# Altium schematic sheet pcb.SchDoc
size A
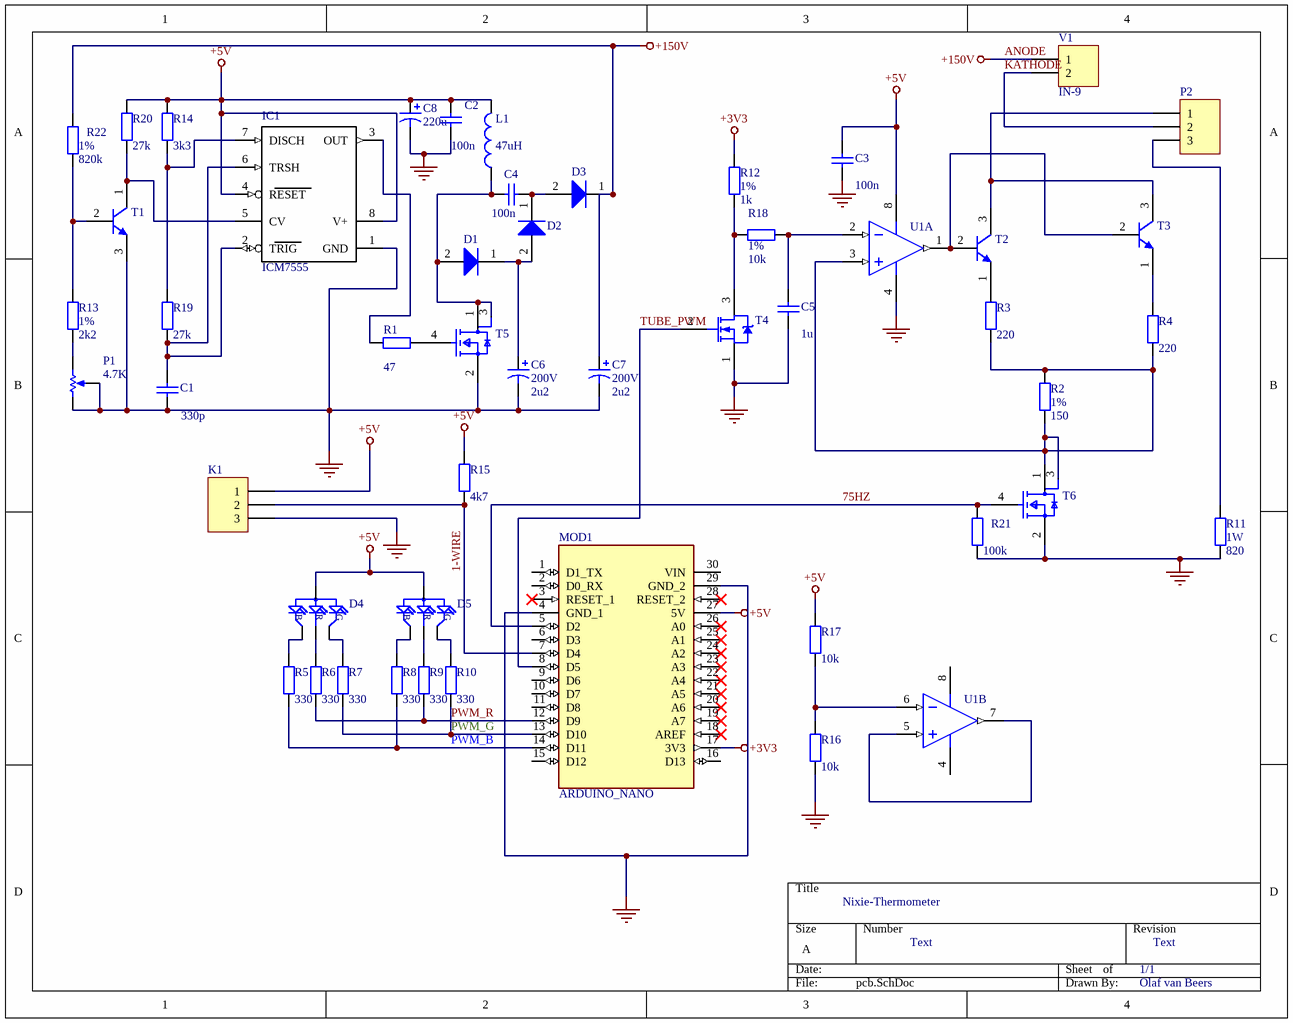
[diagram p0: pcb.SchDoc]

## Parts
C1  value 330p  [RAD-0.3]  (hidden comment: Cap)
C2  value 100n  [RAD-0.3]  (hidden comment: Cap)
C3  value 100n  [RAD-0.3]  (hidden comment: Cap)
C4  value 100n  [RAD-0.3]  (hidden comment: Cap)
C5  value 1u  [RAD-0.3]  (hidden comment: Cap)
C6  200V  value 2u2  [RB7.6-15]
C7  200V  value 2u2  [RB7.6-15]
C8  value 220u  [RB7.6-15]  (hidden comment: Cap Pol1)
D1  MUR160G  [ONSC-AXIAL_LEAD-2-59-10_P]  (value not drawn)
D2  MUR160G  [ONSC-AXIAL_LEAD-2-59-10_P]  (value not drawn)
D3  MUR160G  [ONSC-AXIAL_LEAD-2-59-10_P]  (value not drawn)
D4  DIP-LED-RGB-COMMON-ANODE(4P-D8MM)  [*LED4-2.0-D8.0MM]  (value not drawn)
D5  DIP-LED-RGB-COMMON-ANODE(4P-D8MM)  [*LED4-2.0-D8.0MM]  (value not drawn)
IC1  ICM7555  [*DIL08]
K1  Header 3  [HDR1X3]  (value not drawn)
L1  value 47uH  [INDC3216]  (hidden comment: Inductor)
MOD1  ARDUINO_NANO  [ARDUINO_A000005]
P1  value 4.7K  [VR4]  (hidden comment: RPot)
P2  Header 3  [HDR1X3]  (value not drawn)
R1  value 47  [AXIAL-0.4]  (hidden comment: Res2)
R2  1%  value 150  [AXIAL-0.4]
R3  value 220  [AXIAL-0.4]  (hidden comment: Res2)
R4  value 220  [AXIAL-0.4]  (hidden comment: Res2)
R5  value 330  [AXIAL-0.4]  (hidden comment: Res2)
R6  value 330  [AXIAL-0.4]  (hidden comment: Res2)
R7  value 330  [AXIAL-0.4]  (hidden comment: Res2)
R8  value 330  [AXIAL-0.4]  (hidden comment: Res2)
R9  value 330  [AXIAL-0.4]  (hidden comment: Res2)
R10  value 330  [AXIAL-0.4]  (hidden comment: Res2)
R11  1W  value 820  [AXIAL-0.4]
R12  1%  value 1k  [AXIAL-0.4]
R13  1%  value 2k2  [AXIAL-0.4]
R14  value 3k3  [AXIAL-0.4]  (hidden comment: Res2)
R15  value 4k7  [AXIAL-0.4]  (hidden comment: Res2)
R16  value 10k  [AXIAL-0.4]  (hidden comment: Res2)
R17  value 10k  [AXIAL-0.4]  (hidden comment: Res2)
R18  1%  value 10k  [AXIAL-0.4]
R19  value 27k  [AXIAL-0.4]  (hidden comment: Res2)
R20  value 27k  [AXIAL-0.4]  (hidden comment: Res2)
R21  value 100k  [AXIAL-0.4]  (hidden comment: Res2)
R22  1%  value 820k  [AXIAL-0.4]
T1  BC547B  [ONSC-TO-92-3-29-11]  (value not drawn)
T2  MPSA42  [ONSC-TO-92-3-29-11]  (value not drawn)
T3  MPSA42  [ONSC-TO-92-3-29-11]  (value not drawn)
T4  2N7000  [ONSC-TO-92-3-29-11]  (value not drawn)
T5  IRFD110PBF  [Vishay_X10-0386_MFG]  (value not drawn)
T6  IRFD110PBF  [Vishay_X10-0386_MFG]  (value not drawn)
U1  LM6142AIM  [D0008A_N]  (value not drawn)  (parts A,B of 2)
V1  IN-9  [HDR1X2]

## Nets
+3V3: MOD1.17(3V3) R12.2
+5V: C2.2 C3.2 C8.1 D4.2(POS) D5.2(POS) IC1.4(RESET) IC1.8(V+) K1.1 L1.2 MOD1.27(5V) R14.2 R15.2 R17.2 R20.2 U1.8(V+)
ANODE: C7.1 D3.1(K) R22.2 V1.1  [also labelled +150V]
GND: C1.1 C2.1 C3.1 C5.1 C6.2 C7.2 C8.2 IC1.1(GND) K1.3 MOD1.4(GND_1) MOD1.29(GND_2) P1.1(TOP) P1.3(TAP) R11.2 R16.1 R21.1 T1.3(E) T4.1(S) T5.2(S) T6.2(S) U1.4(V-)
1-WIRE: K1.2 MOD1.7(D4) R15.1
75HZ: MOD1.5(D2) R21.2 T6.4(G)
KATHODE: P2.2 V1.2
PWM_B: MOD1.14(D11) R5.1 R8.1
PWM_G: MOD1.12(D9) MOD1.13(D10) R6.1 R7.1 R9.1 R10.1  [also labelled PWM_R]
TUBE_PWM: MOD1.8(D5) T4.2(G)
NetC1_2: C1.2 IC1.2(TRIG) IC1.6(TRSH) R19.1
NetC4_1: C4.1 D1.2(A) L1.1 T5.1(D) T5.3(D)
NetC4_2: C4.2 D2.1(K) D3.2(A)
NetC5_2: C5.2 R18.2 U1.2(INA-)
NetC6_1: C6.1 D1.1(K) D2.2(A)
NetD4_1: D4.1(R) R6.2
NetD4_3: D4.3(G) R7.2
NetD4_4: D4.4(B) R5.2
NetD5_1: D5.1(R) R9.2
NetD5_3: D5.3(G) R10.2
NetD5_4: D5.4(B) R8.2
NetIC1_3: IC1.3(OUT) R1.1
NetIC1_5: IC1.5(CV) R20.1 T1.1(C)
NetIC1_7: IC1.7(DISCH) R14.1 R19.2
NetP1_2: P1.2(BOT) R13.1
NetP2_1: P2.1 T2.3(C) T3.3(C)
NetP2_3: P2.3 R11.1
NetR1_2: R1.2 T5.4(G)
NetR2_1: R2.1 R2.2 R3.1 R4.1 T6.1(D) T6.3(D) U1.3(INA+)
NetR3_2: R3.2 T2.1(E)
NetR4_2: R4.2 T3.1(E)
NetR12_1: R12.1 R18.1 T4.3(D)
NetR13_2: R13.2 R22.1 T1.2(B)
NetR16_2: R16.2 R17.1 U1.6(INB-)
NetT2_2: T2.2(B) T3.2(B) U1.1(OUTA)
NetU1_5: U1.5(INB+) U1.7(OUTB)

Not connected (* = marked no-connect by the designer): MOD1 1(D1_TX) 2(D0_RX) 3(RESET_1)* 6(D3) 9(D6) 10(D7) 11(D8) 15(D12) 16(D13) 18(AREF)* 19(A7)* 20(A6)* 21(A5)* 22(A4)* 23(A3)* 24(A2)* 25(A1)* 26(A0)* 28(RESET_2)* 30(VIN)

## Notes on the sheet
- Nixie-Thermometer
- Text
- 1/1
- Olaf van Beers

## Library data of the parts
C1-C5 = Cap: Capacitor; Published: 8-Jun-2000; LatestRevisionDate: 17-Jul-2002; LatestRevisionNote: Re-released for DXP Platform.; PackageReference: RAD-0.3; Publisher: Altium Limited; PackageDescription: Radial Cap, Thru-Hole; 2 Leads; 0.3 in Pin Spacing
C6-C8 = Cap Pol1: Polarized Capacitor (Radial); Published: 8-Jun-2000; LatestRevisionDate: 17-Jul-2002; LatestRevisionNote: Re-released for DXP Platform.; PackageReference: RB7.6-15; Publisher: Altium Limited; PackageDescription: Polarized Capacitor (Radial); 2 Leads
D1-D3 = CMP-0902-00129-1: SWITCHMODE(TM) Power Rectifier, 2-Pin Axial_Lead, Pb-Free, Bulk Bag; Manufacturer: On Semiconductor; IFSM Max (A): 35; VRRM Max (V): 600; Type: Ultrafast; PackageVersion: Rev. U, 02/2005; PackageDescription: 2-Pin, Axial Lead, Diameter 2.35 mm; RoHS: TRUE; ComponentLink3Description: Package Specification; ComponentLink3URL: http://www.onsemi.cn/pub_link/Collateral/59-10.PDF; Packing: Bulk Bag; ComponentLink1URL: http://www.onsemi.com/; ComponentLink1Description: Manufacturer URL; ComponentLink2Description: Datasheet; ComponentLink2URL: http://www.onsemi.com/pub_link/Collateral/MUR120-D.PDF; PackageReference: AXIAL_LEAD-2-59-10; Mounting Technology: Through Hole; PartNumber: MUR160G; DatasheetVersion: Rev. 12
D4 D5 = DIP-LED-RGB-COMMON-ANODE(4P-D8MM): DIP LED RGB Common Anode; MF: Chengguangxing; MP: CZXR-80RGB03-A; SnapEDA_Link: https://www.snapeda.com/parts/CZXR-80RGB03-A/Chengguangxing/view-part/106379/?ref=snap; Availability: Unavailable; Price: None; Package: None; Value: *
K1 P2 = Header 3: Header, 3-Pin; LatestRevisionDate: 17-Jul-2002; LatestRevisionNote: Re-released for DXP Platform.; Publisher: Altium Limited
L1 = Inductor: Code_IEC: 1005; Published: 8-Jun-2000; LatestRevisionDate: 29-May-2009; LatestRevisionNote: IPC-7351 Footprint Added.; PackageReference: 0402-A; Publisher: Altium Limited; PackageDescription: Chip Inductor; Code_JEITA: 0402
MOD1 = A000005: ATmega328 Arduino Nano AVRÂ® ATmega AVR MCU 8-Bit Embedded Evaluation Board; Value: *; Digi-Key_Purchase_URL: https://www.digikey.com/product-detail/en/arduino/A000005/1050-1001-ND/2638989?utm_source=snapeda&utm_medium=aggregator&utm_campaign=symbol; Package: None; MP: A000005; SnapEDA_Link: https://www.snapeda.com/parts/A000005/Arduino/view-part/77912/?ref=snap; Digi-Key_Part_Number: 1050-1001-ND; MF: Arduino
P1 = RPot: Potentiometer; Sim Note: Enter the Resistance value and the set point into parameter fields.; Set Position: 0.5; Published: 8-Jun-2000; LatestRevisionDate: 17-Jul-2002; LatestRevisionNote: Re-released for DXP Platform.; PackageReference: VR5; Publisher: Altium Limited; PackageDescription: Variable Resistor, Thru-Hole; 3 Leads
R1-R22 = Res2: Resistor; Published: 8-Jun-2000; LatestRevisionDate: 17-Jul-2002; LatestRevisionNote: Re-released for DXP Platform.; PackageReference: AXIAL-0.4; Publisher: Altium Limited; PackageDescription: Axial Device, Thru-Hole; 2 Leads; 0.4 in Pin Spacing
T1 = CMP-1048-01467-1: Amplifier Transistor, NPN Silicon, 3-Pin TO-92, Bulk Box; Manufacturer: On Semiconductor; IC Continuous (A): 0.1; fT Min (MHz): 150; DatasheetVersion: Rev. 7; ComponentLink1URL: http://www.onsemi.com/; Polarity: NPN; RoHS: FALSE; ComponentLink1Description: Manufacturer URL; Packing: Bulk Box; PackageDescription: 3-Pin Transistor Outline, Body 4.825 x 3.685 mm, Pitch 1.27 mm; ComponentLink3URL: http://www.onsemi.cn/pub_link/Collateral/2N6426-D.PDF; ComponentLink2Description: Datasheet; PackageVersion: Rev. AM; PackageReference: TO-92-3-29-11_AM_SL; ComponentLink3Description: Package Specification; Mounting Technology: Through Hole; PartNumber: BC547B; ComponentLink2URL: http://www.onsemi.com/pub_link/Collateral/BC546-D.PDF
T2 T3 = CMP-1048-01390-1: High Voltage Transistor, NPN Silicon, 3-Pin TO-92, Bulk Box; Manufacturer: On Semiconductor; fT Min (MHz): 50; Note1: 0; IC Continuous (A): 0.5; ComponentLink3Description: Package Specification; PackageReference: TO-92-3-29-11_AM_SL; Packing: Bulk Box; ComponentLink1URL: http://www.onsemi.com/; PackageDescription: 3-Pin Transistor Outline, Body 4.825 x 3.685 mm, Pitch 1.27 mm; Mounting Technology: Through Hole; RoHS: FALSE; DatasheetVersion: Rev. 8; PackageVersion: Rev. AM; ComponentLink2Description: Datasheet; ComponentLink1Description: Manufacturer URL; ComponentLink2URL: http://www.onsemi.cn/pub_link/Collateral/MPSA42-D.PDF; ComponentLink3URL: http://www.onsemi.cn/pub_link/Collateral/2N6426-D.PDF; Polarity: NPN; PartNumber: MPSA42
T4 = CMP-1058-00936-1: Small Signal MOSFET, 200 mA, 60 V, N-Channel, 3-Pin TO-92, Bulk Box; Manufacturer: On Semiconductor; Ciss Typ (pF): 60; VGS(th) Max (V): 3; Crss Typ (pF): 5; Channel Polarity: N Channel; VGS Max (V): 20; Configuration: Single; PD Max (W): 0.35; Coss Typ (pF): 25; ID Max (A): 0.2; PackageVersion: Rev. AM; ComponentLink3URL: http://www.onsemi.cn/pub_link/Collateral/2N6426-D.PDF; ComponentLink2URL: http://www.onsemi.com/pub_link/Collateral/2N7000-D.PDF; DatasheetVersion: Rev. 8; Mounting Technology: Through Hole; V(BR)DSS Min (V): 60; PartNumber: 2N7000; PackageDescription: 3-Pin Transistor Outline, Body 4.825 x 3.685 mm, Pitch 1.27 mm; ComponentLink2Description: Datasheet; ComponentLink1URL: http://www.onsemi.com/; PackageReference: TO-92-3-29-11_AM_SL; Packing: Bulk Box; ComponentLink1Description: Manufacturer URL; Package Type: TO-92; ComponentLink3Description: Package Specification
U1 = CMP-0055-00760-3: Dual High Speed/Low Power 17 MHz Rail-to-Rail I/O Operational Amplifier, 8-pin Narrow SOIC; Manufacturer: Texas Instruments; PowerWise: N; CompType: Amplifiers; PackageTopMarking: NSZXTT*LM614*2AIM; PinCount: 8; Package Reference: D0008A; Code_IPC: SOIC127P600-8; PackageDescription: SOIC Narrow, 4.9 x 3.9 x 1.45mm, 8 Lead, 1.27mm Pitch; ComponentLink1URL: http://www.ti.com/general/docs/lit/getliterature.tsp?genericPartNumber=LM6142&fileType=pdf; Code_JEDEC: MS-012-AA; RoHS: N; ComponentLink1Description: Datasheet URL
V1 = Header 2: Header, 2-Pin; LatestRevisionDate: 17-Jul-2002; LatestRevisionNote: Re-released for DXP Platform.; Publisher: Altium Limited
IC1 = ICM7555: SnapEDA_Link: https://www.snapeda.com/parts/ICM7555/Renesas%20Electronics%20America%20Inc./view-part/571575/?ref=snap; Value: *